# Altium schematic sheet 05 - QSPI & SD-CARD.SchDoc
size A4
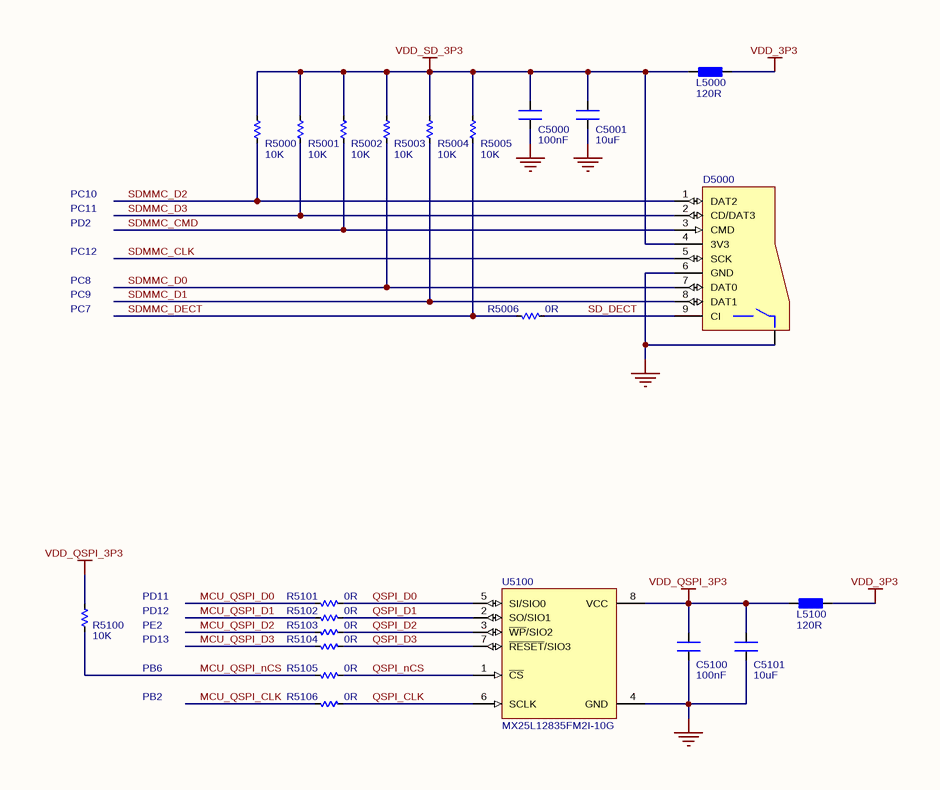
[diagram p0: 05 - QSPI & SD-CARD.SchDoc]

## Parts
C5000  value 100nF  [CN-SMD-0402]  (hidden comment: Capacitor)
C5001  value 10uF  [CN-SMD-0603]  (hidden comment: Capacitor)
C5100  value 100nF  [CN-SMD-0402]  (hidden comment: Capacitor)
C5101  value 10uF  [CN-SMD-0603]  (hidden comment: Capacitor)
D5000  microSD card socket  [MICROSD1]  (value not drawn)
L5000  value 120R  [L-SMD-0402]  (hidden comment: Ferrite bead)
L5100  value 120R  [L-SMD-0402]  (hidden comment: Ferrite bead)
R5000  value 10K  [RES-SMD-0402]  (hidden comment: Resistor)
R5001  value 10K  [RES-SMD-0402]  (hidden comment: Resistor)
R5002  value 10K  [RES-SMD-0402]  (hidden comment: Resistor)
R5003  value 10K  [RES-SMD-0402]  (hidden comment: Resistor)
R5004  value 10K  [RES-SMD-0402]  (hidden comment: Resistor)
R5005  value 10K  [RES-SMD-0402]  (hidden comment: Resistor)
R5006  value 0R  [RES-SMD-0402]  (hidden comment: Resistor)
R5100  value 10K  [RES-SMD-0402]  (hidden comment: Resistor)
R5101  value 0R  [RES-SMD-0402]  (hidden comment: Resistor)
R5102  value 0R  [RES-SMD-0402]  (hidden comment: Resistor)
R5103  value 0R  [RES-SMD-0402]  (hidden comment: Resistor)
R5104  value 0R  [RES-SMD-0402]  (hidden comment: Resistor)
R5105  value 0R  [RES-SMD-0402]  (hidden comment: Resistor)
R5106  value 0R  [RES-SMD-0402]  (hidden comment: Resistor)
U5100  MX25L12835FM2I-10G  [SOIC127P798X216-8N]

## Nets
GND: C5000.1 C5001.1 C5100.1 C5101.1 D5000.0(NC) D5000.6(GND) U5100.4(GND)
VDD_3P3: L5000.1 L5100.1
VDD_QSPI_3P3: C5100.2 C5101.2 L5100.2 R5100.1 U5100.8(VCC)
VDD_SD_3P3: C5000.2 C5001.2 D5000.4(3V3) L5000.2 R5000.1 R5001.1 R5002.1 R5003.1 R5004.1 R5005.1
MCU_QSPI_CLK: R5106.2
MCU_QSPI_D0: R5101.2
MCU_QSPI_D1: R5102.2
MCU_QSPI_D2: R5103.2
MCU_QSPI_D3: R5104.2
MCU_QSPI_nCS: R5100.2 R5105.2
QSPI_CLK: R5106.1 U5100.6(SCLK)
QSPI_D0: R5101.1 U5100.5(SI/SIO0)
QSPI_D1: R5102.1 U5100.2(SO/SIO1)
QSPI_D2: R5103.1 U5100.3(~{WP}/SIO2)
QSPI_D3: R5104.1 U5100.7(~{RESET}/SIO3)
QSPI_nCS: R5105.1 U5100.1(~{CS})
SD_DECT: D5000.9(CI) R5006.1
SDMMC_CLK: D5000.5(SCK)
SDMMC_CMD: D5000.3(CMD) R5002.2
SDMMC_D0: D5000.7(DAT0) R5003.2
SDMMC_D1: D5000.8(DAT1) R5004.2
SDMMC_D2: D5000.1(DAT2) R5000.2
SDMMC_D3: D5000.2(CD/DAT3) R5001.2
SDMMC_DECT: R5005.2 R5006.2

## Notes on the sheet
- PC10
- PC11
- PD2
- PC8
- PC9
- PC12
- PC7
- PD11
- PD12
- PD13
- PE2
- PB2
- PB6

## Library data of the parts
C5000 C5100 = Cap: Ceramic Capacitor SMD 0402 100nF ±20% 16V
C5001 C5101 = Cap: Ceramic Capacitor SMD 0603 10uF ±20% 10V
D5000 = microSD card SDIO
L5000 L5100 = Ferrite bead: Ferrite bead SMD 0402 120 Ohm @100MHz
R5000-R5005 R5100 = Res: Resistor SMD 0402 10K 1% 0.063W
R5006 R5101-R5106 = Res: Resistor SMD 0402 0R 1% 0.063W
U5100 = MX25L12835FM2I-10G: Macronix 3V, 128M-BIT [x1/x2/x4] CMOS MXSMIO® (Serial Multi I/O) Flash Memory